# Altium schematic sheet Nguon3V.SchDoc
size A; SheetNumber: 7; SheetTotal: 7
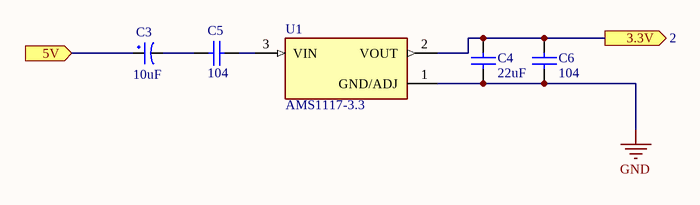
[diagram p0: Nguon3V.SchDoc]

## Parts
C3  10uF  [tu hoa 4mm]
C4  22uF  [tu tantalum dip5.08]
C5  104  [tu gom]
C6  104  [tu gom]
U1  AMS1117-3.3  [SOT229P700X180-4N]

## Ports
3.3V (out, see 2), 5V (in)

## Nets
GND: C4.2 C6.2 U1.1(GND/ADJ)
3.3V: C4.1 C6.1 U1.2(VOUT) ; port 3.3V
5V: C3.1 ; port 5V
NetC3_2: C3.2 C5.2
NetC5_1: C5.1 U1.3(VIN)

## Library data of the parts
C3 = Tu Hoa 10uF 16V 4x7: Cắm; So_Chan: 2; Don_Vi: Con; Ten_Linh_Kien: Tụ Hóa 10uF 16V; Ma_Hang: MH006855; Chung_Loai: Cắm; Kieu_Chan: *
C4 = Tu tantalum 0.22uF 50V DIP5.08: Cắm; Don_Vi: Con; So_Chan: 2; Ten_Linh_Kien: Tụ tantalum 224-0.22uF 50V DIP5.08 sứ vàng; Ma_Hang: MH007473; Chung_Loai: Cắm; Kieu_Chan: *
C5 C6 = Tu gom 104 50V: Cắm; So_Chan: 2; Ten_Linh_Kien: Tụ gốm 104 100nF 50V; Don_Vi: Con; Ma_Hang: MH004761; Chung_Loai: Cắm; Kieu_Chan: *
U1 = AMS1117-3.3: Sot223/Pkg 1-Amp 3.3-Volt Low Drop Out Voltage Regulatator; MF: Advanced Monolithic Systems; SnapEDA_Link: https://www.snapeda.com/parts/AMS1117-3.3/Advanced+Monolithic+Systems/view-part/?ref=snap; Package: SOT-223 Seeed Technology; Value: *; MP: AMS1117-3.3; Check_prices: https://www.snapeda.com/parts/AMS1117-3.3/Advanced+Monolithic+Systems/view-part/?ref=eda